# Altium project PCB_Project.PrjPcb
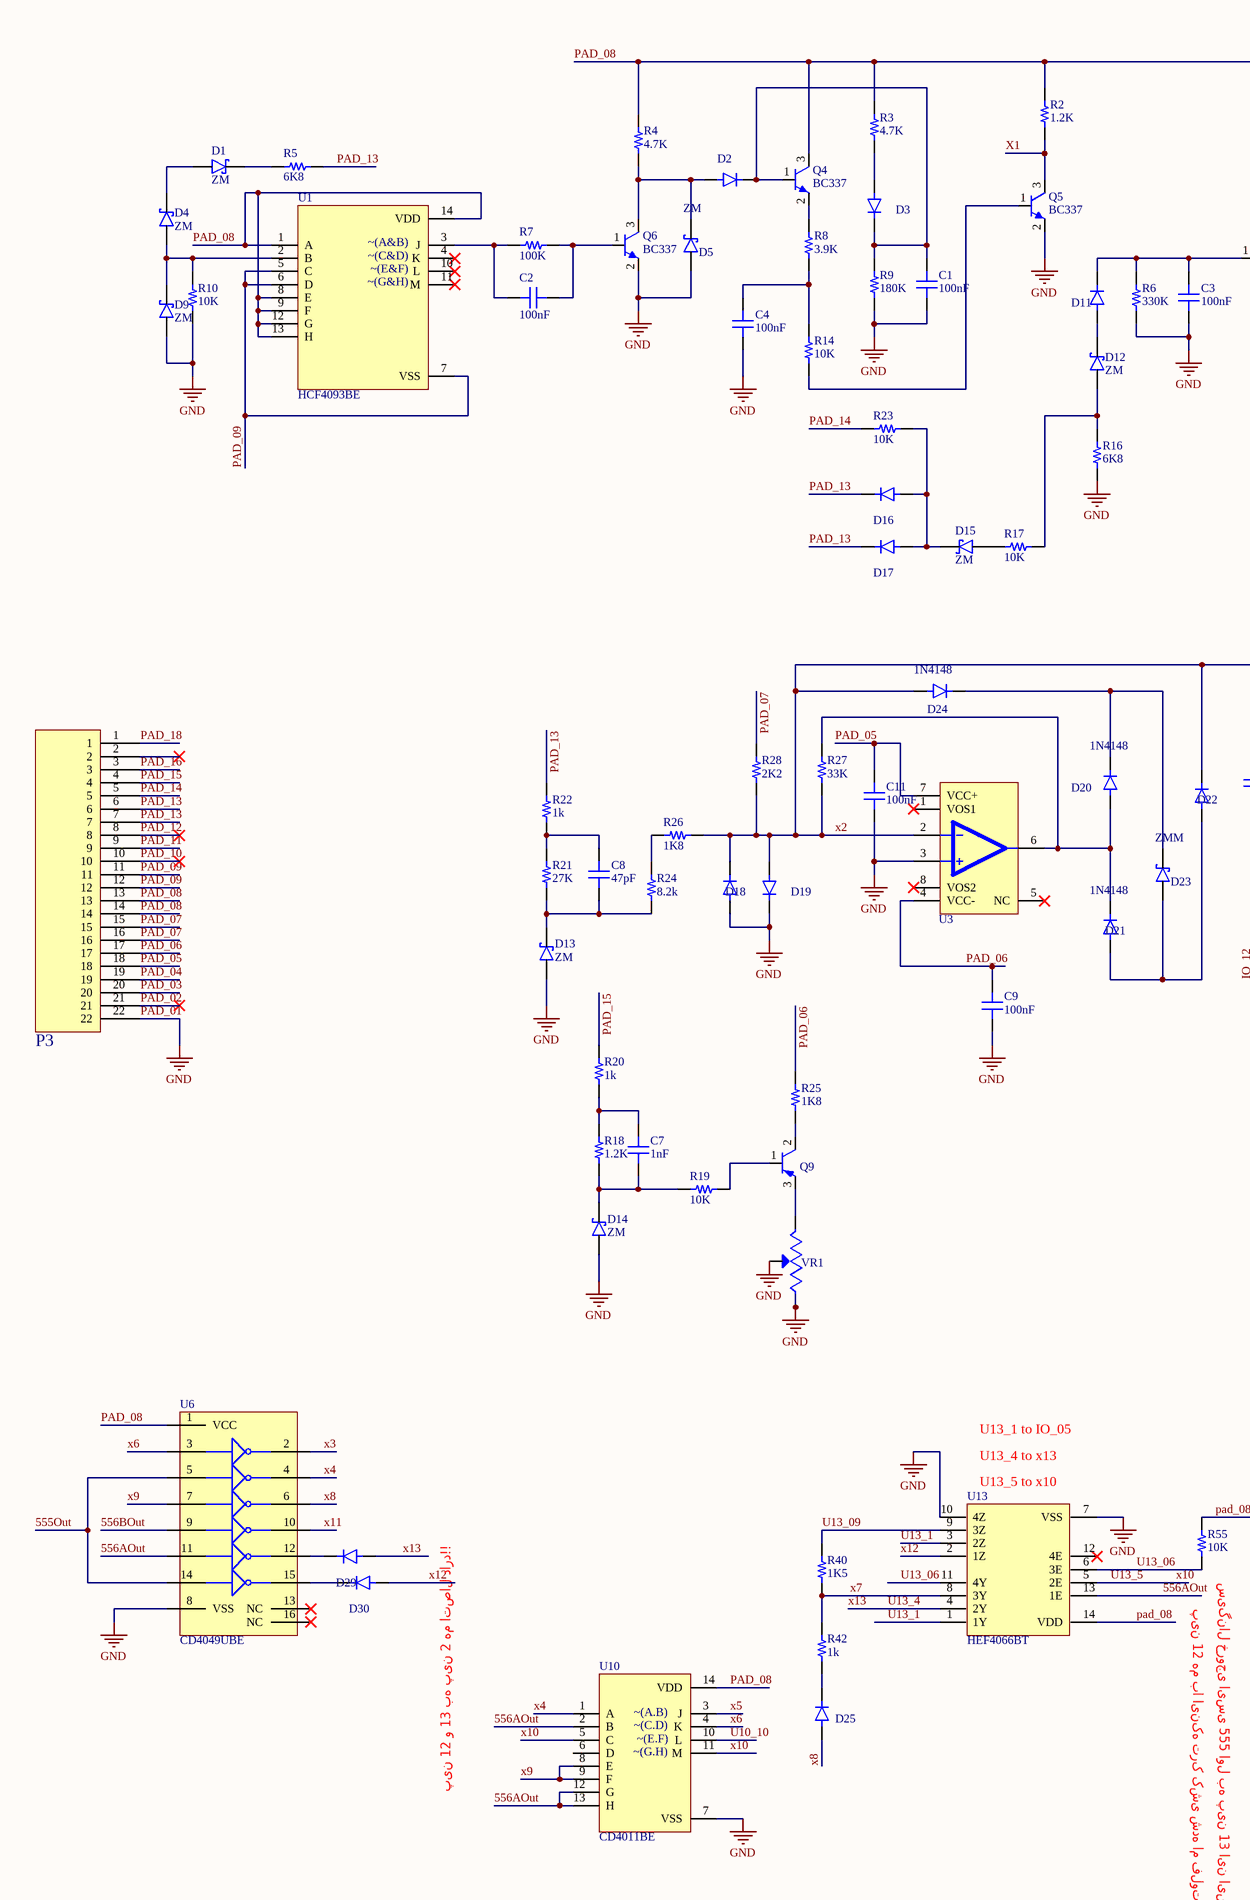
[diagram p0: Sheet1.SchDoc, left]
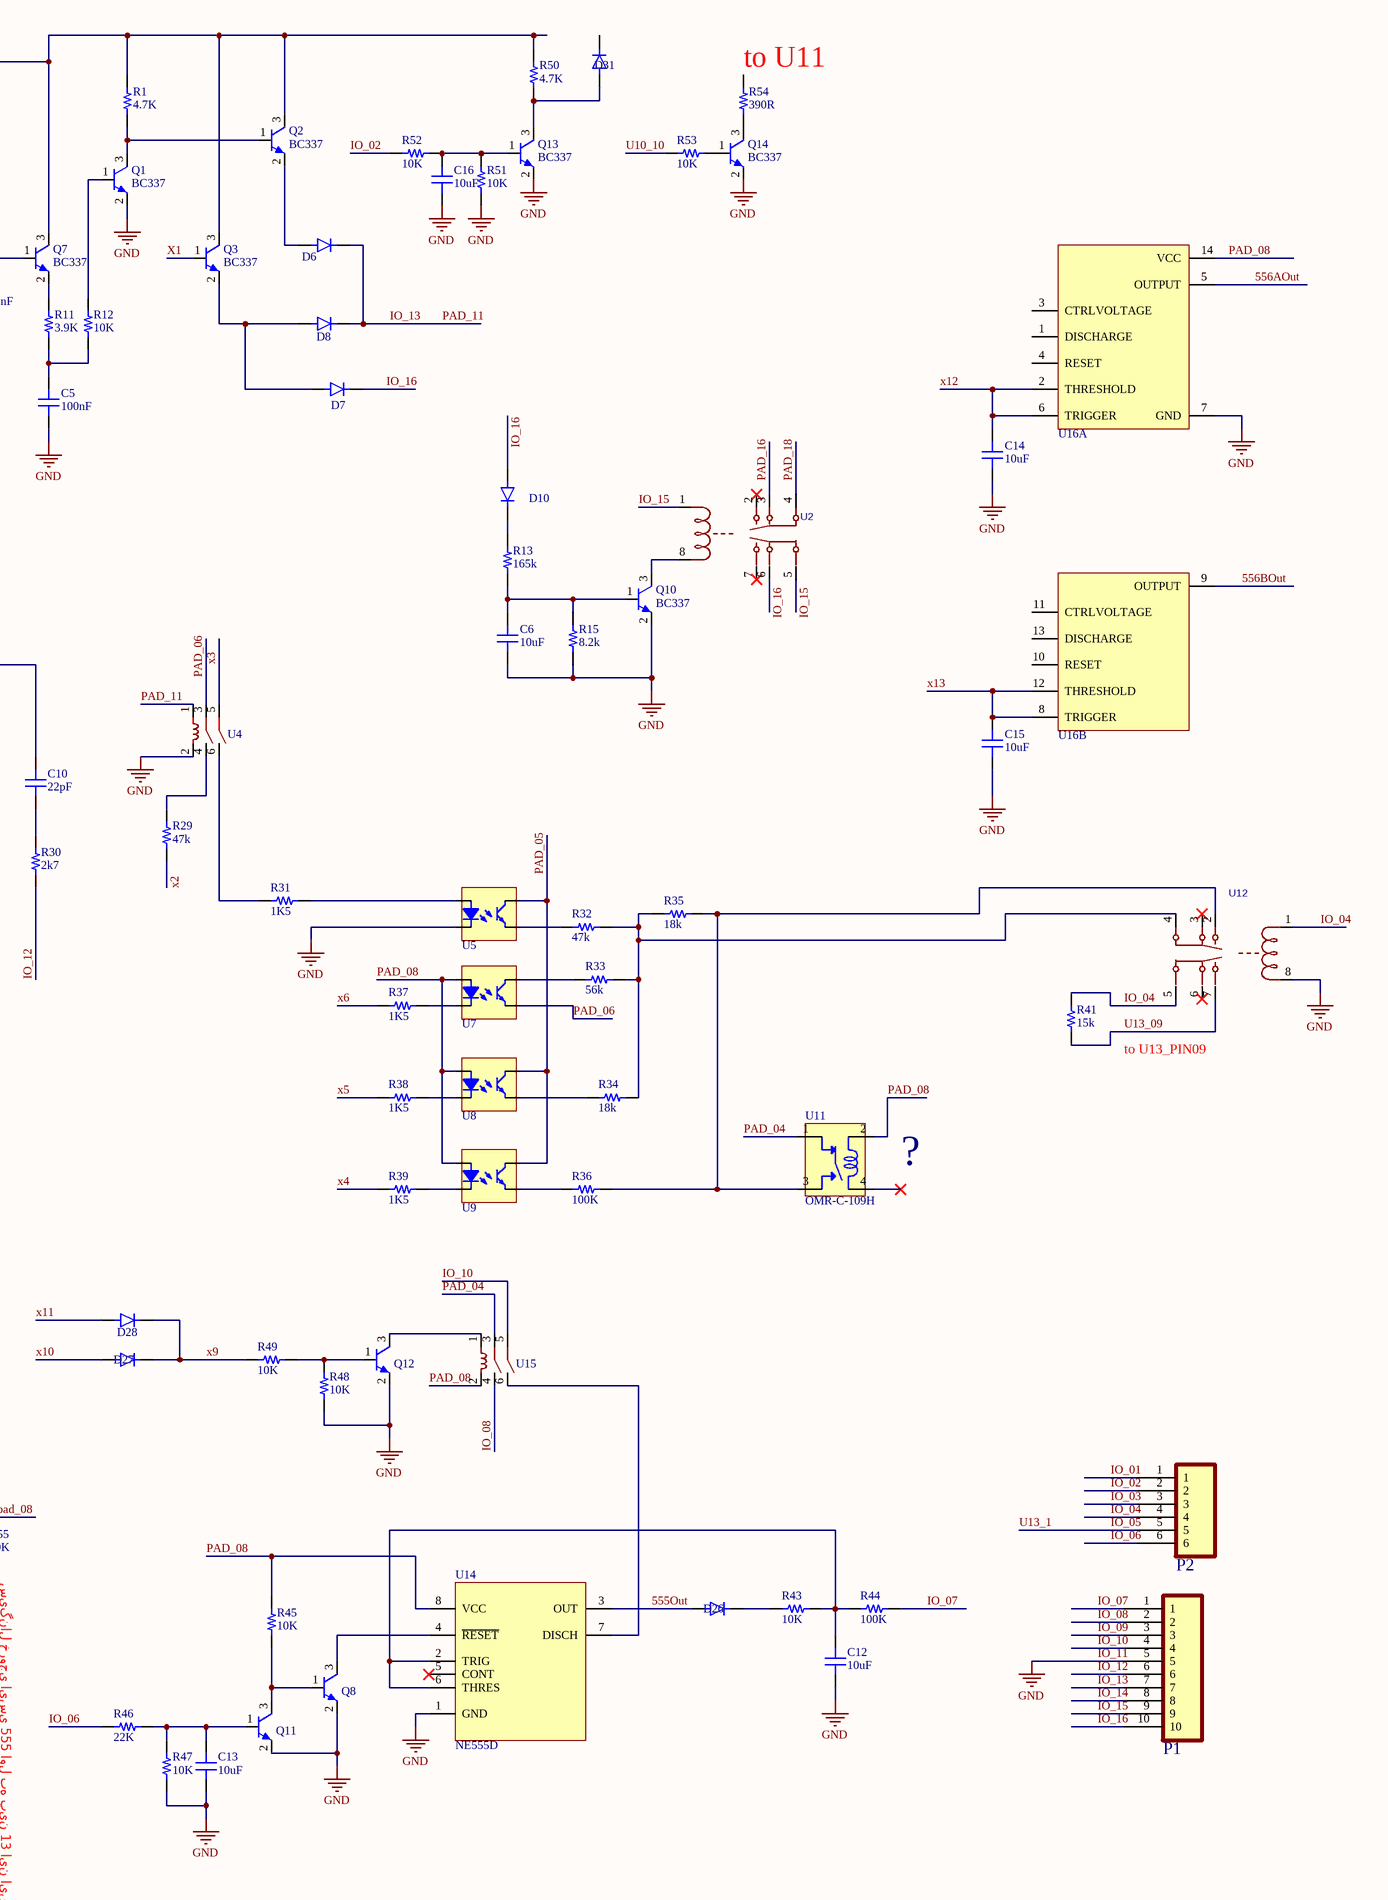
[diagram p1: Sheet1.SchDoc, right]
1 sheet, 136 parts. Net scope: global (net labels, ports and power ports of the same name join across sheets).

## Sheet Sheet1.SchDoc
size C

### Parts
C1  100nF  [Cap0805]
C2  100nF  [Cap0805]
C3  100nF  [Cap0805]
C4  100nF  [Cap0805]
C5  100nF  [Cap0805]
C6  10uF  [Cap0603]
C7  1nF  [Cap0805]
C8  47pF  [Cap0603]
C9  100nF  [Cap0805]
C10  22pF  [Cap0603]
C11  100nF  [Cap0805]
C12  10uF  [Cap1206]
C13  10uF  [Cap0805]
C14  10uF  [Cap1206]
C15  10uF  [Cap1206]
C16  10uF  [Cap1206]
D1  ZM  [Melf]
D2  1N4148  [SOD-123]  (value not drawn)
D3  1N4148  [SOD-123]  (value not drawn)
D4  ZM  [Melf]
D5  ZM  [Melf]
D6  1N4148  [SOD-123]  (value not drawn)
D7  1N4148  [SOD-123]  (value not drawn)
D8  1N4148  [SOD-123]  (value not drawn)
D9  ZM  [Melf]
D10  1N4148  [SOD-123]  (value not drawn)
D11  1N4148  [SOD-123]  (value not drawn)
D12  ZM  [Melf]
D13  ZM  [Melf]
D14  ZM  [Melf]
D15  ZM  [Melf]
D16  1N4148  [SOD-123]  (value not drawn)
D17  1N4148  [SOD-123]  (value not drawn)
D18  1N4148  [SOD-123]  (value not drawn)
D19  1N4148  [SOD-123]  (value not drawn)
D20  1N4148  [SOD-123]
D21  1N4148  [SOD-123]
D22  1N4148  [SOD-123]  (value not drawn)
D23  ZMM  [MINIMELF]
D24  1N4148  [SOD-123]
D25  1N4148  [SOD-123]  (value not drawn)
D26  1N4148  [SOD-123]  (value not drawn)
D27  1N4148  [SOD-123]  (value not drawn)
D28  1N4148  [SOD-123]  (value not drawn)
D29  1N4148  [SOD-123]  (value not drawn)
D30  1N4148  [SOD-123]  (value not drawn)
D31  1N4148  [SOD-123]  (value not drawn)
P1  PWR_HDR_10P  [PWR_HDR_10P]  (value not drawn)
P2  PWR_HDR_6P  [PWR_HDR_6P]  (value not drawn)
P3  PCI  [PCI]  (value not drawn)
Q1  BC337  [TO92]
Q2  BC337  [TO92]
Q3  BC337  [TO92]
Q4  BC337  [TO92]
Q5  BC337  [TO92]
Q6  BC337  [TO92]
Q7  BC337  [TO92]
Q8  BC337  [TO92]  (value not drawn)
Q9  BC177  [TO-18]  (value not drawn)
Q10  BC337  [TO92]
Q11  BC337  [TO92]  (value not drawn)
Q12  BC337  [TO92]  (value not drawn)
Q13  BC337  [TO92]
Q14  BC337  [TO92]
R1  4.7K  [Res1206]
R2  1.2K  [Res1206]
R3  4.7K  [Res1206]
R4  4.7K  [Res1206]
R5  6K8  [Res1206]
R6  330K  [Res1206]
R7  100K  [Res1206]
R8  3.9K  [Res1206]
R9  180K  [Res1206]
R10  10K  [Res1206]
R11  3.9K  [Res1206]
R12  10K  [Res1206]
R13  165k  [Res1206]
R14  10K  [Res1206]
R15  8.2k  [Res1206]
R16  6K8  [Res1206]
R17  10K  [Res1206]
R18  1.2K  [Res1206]
R19  10K  [Res1206]
R20  1k  [Res1206]
R21  27K  [Res1206]
R22  1k  [Res1206]
R23  10K  [Res1206]
R24  8.2k  [Res1206]
R25  1K8  [Res1206]
R26  1K8  [Res1206]
R27  33K  [Res1206]
R28  2K2  [Res1206]
R29  47k  [Res1206]
R30  2k7  [Res1206]
R31  1K5  [Res1206]
R32  47k  [Res1206]
R33  56k  [Res1206]
R34  18k  [Res1206]
R35  18k  [Res1206]
R36  100K  [Res0603]
R37  1K5  [Res1206]
R38  1K5  [Res1206]
R39  1K5  [Res1206]
R40  1K5  [Res1206]
R41  15k  [Res1206]
R42  1k  [Res1206]
R43  10K  [Res1206]
R44  100K  [Res1206]
R45  10K  [Res1206]
R46  22K  [Res1206]
R47  10K  [Res1206]
R48  10K  [Res1206]
R49  10K  [Res1206]
R50  4.7K  [Res1206]
R51  10K  [Res1206]
R52  10K  [Res1206]
R53  10K  [Res1206]
R54  390R  [Res1206]
R55  10K  [Res1206]
U1  HCF4093BE  [HCF4093BE]
U2  HRS2H-S-DC24V  [HRS2H-S-DC24V]  (value not drawn)
U3  OP07CD  [SOP8]  (value not drawn)
U4  OL-C-212H  [ol-c-212H]  (value not drawn)
U5  TLP521-1  [TLP521-1]  (value not drawn)
U6  CD4049UBE  [PDIP-16]
U7  TLP521-1  [TLP521-1]  (value not drawn)
U8  TLP521-1  [TLP521-1]  (value not drawn)
U9  TLP521-1  [TLP521-1]  (value not drawn)
U10  CD4011BE  [PDIP-14]
U11  OMR-C-109H
U12  HRS2H-S-DC24V  [HRS2H-S-DC24V]  (value not drawn)
U13  HEF4066BT  [SOIC-14]
U14  NE555D  [SOP8]
U15  OL-C-212H  [ol-c-212H]  (value not drawn)
U16  NE556D  [SOIC-14]  (value not drawn)  (parts A,B of 2)
VR1  10k  [Multi_Turn]  (value not drawn)

### Nets
IO_11: C1.1 C3.2 C4.1 C5.1 C6.1 C9.1 C11.1 C12.1 C13.1 C14.1 C15.1 C16.2 D5.A D9.A D13.A D14.A D18.A D19.C P1.5 P3.22 Q1.2(E) Q5.2(E) Q6.2(E) Q8.2(E) Q10.2(E) Q11.2(E) Q12.2(E) Q13.2(E) Q14.2(E) R6.1 R9.2 R10.1 R15.1 R16.1 R47.1 R48.1 R51.1 U3.3(IN+) U4.2 U5.2 U6.8(VSS) U10.7(VSS) U12.8 U13.7(VSS) U13.10(4Z) U14.1(GND) U16.7(GND) VR1.1(CCW) VR1.2(WIPER)  [also labelled GND, PAD_01]
555Out: D26.A U6.5(B) U6.14(F) U14.3(OUT)
556AOut: U6.11(E) U10.2(B) U10.12(G) U10.13(H) U13.13(1E) U16.5(OUTPUT)
556BOut: U6.9(D) U16.9(OUTPUT)
IO_01: P2.1
IO_02: P2.2 R52.2
IO_03: P2.3
IO_04: P2.4 R41.2 U12.1 U12.5
IO_05: P2.5 U13.1(1Y) U13.3(2Z)  [also labelled U13_1]
IO_06: P2.6 R46.1
IO_07: P1.1 R44.1
IO_08: P1.2 U15.4
IO_09: P1.3
IO_10: P1.4 U15.5
IO_12: P1.6 R30.1
IO_13: D6.C D8.C P1.7 P3.9 U4.1  [also labelled PAD_11]
IO_14: P1.8
IO_15: P1.9 U2.1 U2.5
IO_16: D7.C D10.A P1.10 U2.6
PAD_02: P3.21
PAD_03: P3.20
PAD_04: P3.19 U11.1 U15.3
PAD_05: C11.2 P3.18 U3.7(VCC+) U5.4 U8.4 U9.4
PAD_06: C9.2 P3.17 R25.1 U3.4(VCC-) U4.3 U7.3
PAD_07: P3.15 P3.16 R28.1
PAD_08: P3.13 P3.14 Q2.3(C) Q3.3(C) Q4.3(C) Q7.3(C) R1.1 R2.2 R3.2 R4.2 R45.2 R50.2 R55.2 U1.1(A) U1.8(E) U1.9(F) U1.12(G) U1.13(H) U1.14(VDD) U6.1(VCC) U7.1 U8.1 U9.1 U10.14(VDD) U11.2 U13.14(VDD) U14.8(VCC) U15.2 U16.14(VCC)
PAD_09: P3.11 P3.12 U1.5(C) U1.6(D) U1.7(VSS)
PAD_10: P3.10
PAD_12: P3.8
PAD_13: D16.C D17.C P3.6 P3.7 R5.2 R22.1
PAD_14: P3.5 R23.1
PAD_15: P3.4 R20.1
PAD_16: P3.3 U2.3
PAD_18: P3.1 U2.4
U10_10: R53.2 U10.10(L)
U13_4: C15.2 D29.A U13.4(2Y) U16.8(TRIGGER) U16.12(THRESHOLD)  [also labelled x13]
U13_5: D27.A U10.5(C) U10.11(M) U13.5(2E)  [also labelled x10]
U13_06: R55.1 U13.6(3E) U13.11(4Y)
U13_09: R40.1 R41.1 U12.7 U13.9(3Z)
X1: Q3.1(B) Q5.3(C) R2.1
x2: C10.2 D18.C D19.A D22.C D24.A R26.1 R27.1 R28.2 R29.1 U3.2(IN-)
x3: U4.5 U6.2(G)
x4: R39.1 U6.4(H) U10.1(A)
x5: R38.1 U10.3(J)
x6: R37.1 U6.3(A) U10.4(K)
x7: R40.2 R42.1 U13.8(3Y)
x8: D25.A U6.6(I)
x9: D27.C D28.C R49.2 U6.7(C) U10.8(E) U10.9(F)
x11: D28.A U6.10(J)
x12: C14.2 D30.A U13.2(1Z) U16.2(THRESHOLD) U16.6(TRIGGER)
NetC1_2: C1.2 D2.C D3.C Q4.1(B) R9.1
NetC2_1: C2.1 R7.1 U1.3(J)
NetC2_2: C2.2 Q6.1(B) R7.2
NetC3_1: C3.1 D11.C Q7.1(B) R6.2
NetC4_2: C4.2 R8.2 R14.2
NetC5_2: C5.2 R11.1 R12.1
NetC6_2: C6.2 Q10.1(B) R13.1 R15.2
NetC7_1: C7.1 D14.C R18.1 R19.1
NetC7_2: C7.2 R18.2 R20.2
NetC8_1: C8.1 D13.C R21.2 R24.2
NetC8_2: C8.2 R21.1 R22.2
NetC10_1: C10.1 R30.2
NetC12_2: C12.2 R43.2 R44.2 U14.2(TRIG) U14.6(THRES)
NetC13_2: C13.2 Q11.1(B) R46.2 R47.2
NetC16_1: C16.1 Q13.1(B) R51.2 R52.1
NetD1_A: D1.A D4.C
NetD1_C: D1.C R5.1
NetD2_A: D2.A D5.C Q6.3(C) R4.1
NetD3_A: D3.A R3.1
NetD4_A: D4.A D9.C R10.2 U1.2(B)
NetD6_A: D6.A Q2.2(E)
NetD7_A: D7.A D8.A Q3.2(E)
NetD10_C: D10.C R13.2
NetD11_A: D11.A D12.C
NetD12_A: D12.A R16.2 R17.2
NetD15_A: D15.A R17.1
NetD15_C: D15.C D16.A D17.A R23.2
NetD20_A: D20.A D21.C R27.2 U3.6(OUT)
NetD20_C: D20.C D23.C D24.C
NetD21_A: D21.A D22.A D23.A
NetD25_C: D25.C R42.2
NetD26_C: D26.C R43.1
NetD29_C: D29.C U6.12(K)
NetD30_C: D30.C U6.15(L)
NetD31_A: D31.A Q13.3(C) R50.1
NetQ1_1: Q1.1(B) R12.2
NetQ1_3: Q1.3(C) Q2.1(B) R1.2
NetQ4_2: Q4.2(E) R8.1
NetQ5_1: Q5.1(B) R14.1
NetQ7_2: Q7.2(E) R11.2
NetQ8_1: Q8.1(B) Q11.3(C) R45.1
NetQ8_3: Q8.3(C) U14.4(~{RESET})
NetQ9_1: Q9.1(B) R19.2
NetQ9_2: Q9.2(C) R25.2
NetQ9_3: Q9.3(E) VR1.3(CW)
NetQ10_3: Q10.3(C) U2.8
NetQ12_1: Q12.1(B) R48.2 R49.1
NetQ12_3: Q12.3(C) U15.1
NetQ14_1: Q14.1(B) R53.1
NetQ14_3: Q14.3(C) R54.1
NetR24_1: R24.1 R26.2
NetR29_2: R29.2 U4.4
NetR31_1: R31.1 U4.6
NetR31_2: R31.2 U5.1
NetR32_1: R32.1 R33.1 R34.1 R35.1 U12.4
NetR32_2: R32.2 U5.3
NetR33_2: R33.2 U7.4
NetR34_2: R34.2 U8.3
NetR35_2: R35.2 R36.2 U11.3 U12.2
NetR36_1: R36.1 U9.3
NetR37_2: R37.2 U7.2
NetR38_2: R38.2 U8.2
NetR39_2: R39.2 U9.2
NetU14_7: U14.7(DISCH) U15.6

Not connected (* = marked no-connect by the designer): D31 C; P3 2*; R54 2; U1 4(K)* 10(L)* 11(M)*; U2 2* 7*; U3 1(VOS1)* 5(NC)* 8(VOS2)*; U6 13(NC)* 16(NC)*; U10 6(D); U11 4*; U12 3* 6*; U13 12(4E)*; U14 5(CONT)*; U16 1(DISCHARGE) 3(CTRLVOLTAGE) 4(RESET) 10(RESET) 11(CTRLVOLTAGE) 13(DISCHARGE)

### Notes on the sheet
- (near R54) to U11
- to U13_PIN09
- ?
- U13_1 to IO_05
- U13_4 to x13
- (near U13) U13_5 to x10
- پین 12 هم با اینکه ترک کشی شده ام فلوت رها شده باز هم چک شود
- (near R55) سیگنال خروجی ایسی 555 اول به پین 13 این ایسی هم می اید
- پین 12 و 13 به پین 2 هم اتصال دارد!!
- (in symbol CD4011BE) ~(A.B); ~(C.D); ~(E.F); ~(G.H)
- (in symbol HCF4093BE) ~(A&B); ~(C&D); ~(E&F); ~(G&H)

### Library data of the parts
C1 C3-C5 C9 C11 = Cap-0805-100nF: Cap 0805 100nF; Manufacturer: ---; ID: 51; Additionner: S.Pourmohammad; Part Number: Cap-0805-100nF; Category: Cap; Sub-Category: Cer0805; Adding Time: 1402-05-18; Datasheet Path: ---; Supplier: Ic Kala
C2 = C0805C104K5RACAUTO: Multilayer Ceramic Capacitors MLCC - SMD 50V 100nF X7R 0805 10% AEC-Q200; Manufacturer: KEMET; ID: 11; Additionner: M.Moghimi; Part Number: C0805C104K5RACAUTO; Category: Cap; Sub-Category: Cer0805; Adding Time: 1400-09-09; Datasheet Path: Datasheets\KEM_C1002_X7R_SMD Capacitor Series.pdf
C6 = Cap-0603-10uF: Cap 0603 10uF; Manufacturer: ---; ID: 40; Additionner: A.Abdolahzadeh; Part Number: Cap-0603-10uF; Category: Cap; Sub-Category: Cer0603; Adding Time: 1401-05-17; Datasheet Path: ---
C7 = Cap-0805-1nF: Cap 0805 1nF; Manufacturer: ---; ID: 116; Additionner: S.Pourmohammad; Part Number: Cap-0805-1nF; Category: Cap; Sub-Category: Cer0805; Adding Time: 1402-05-18; Datasheet Path: ---; Supplier: Ic Kala
C8 = Cap-0603-47pF: Cap 0603 47pF; Manufacturer: ---; ID: 0; Additionner: A.Abdolahzadeh; Part Number: Cap-0603-47pF; Category: Cap; Sub-Category: Cer0603; Adding Time: 1402-09-24; Datasheet Path: ---
C10 = Cap-0603-22pF: Cap 0603 22pF; Manufacturer: ---; ID: 114; Additionner: A.Abdolahzadeh; Part Number: Cap-0603-22pF; Category: Cap; Sub-Category: Cer0603; Adding Time: 1401-04-30; Datasheet Path: ---; Supplier: Ic Kala
C12 C14-C16 = Cap-1206-10uF: Cap 1206 10uF 50V; Manufacturer: ---; ID: 48; Additionner: S.Pourmohammad; Part Number: Cap-1206-10uF; Category: Cap; Sub-Category: Cer1206; Adding Time: 1401-06-09; Datasheet Path: ---; Supplier: Ic Kala
C13 = Cap-0805-10uF: Cap 0805 10uF; Manufacturer: ---; ID: 49; Additionner: S.Pourmohammad; Part Number: Cap-0805-10uF; Category: Cap; Sub-Category: Cer0805; Adding Time: 1401-05-17; Datasheet Path: ---; Supplier: Ic Kala
D1 D5 D9 D15 = ZM: Zener Diode Melf; MP: TMMBAT41; MF: STMicroelectronics; ID: 132; Additionner: S.Pourmohammad; SnapEDA_Link: https://www.snapeda.com/parts/TMMBAT41/STMicroelectronics/view-part/2894620/?ref=snap; Value: *; Availability: Not in stock; Check_prices: https://www.snapeda.com/parts/TMMBAT41/STMicroelectronics/view-part/2894620/?ref=eda; Package: DO-213 STMicroelectronics; Price: None; Part Number: ZM; Category: Diode; Sub-Category: Zener
D2 D3 D6-D8 D10 D11 D16-D22 D24-D31 = 1N4148: Diode Standard 75 V 300mA (DC) Through Hole DO-35 Mimi Melf; MF: ON Semiconductor; ID: 113; Additionner: S.Pourmohammad; Price: None; Value: *; Check_prices: https://www.snapeda.com/parts/1N4148/Onsemi/view-part/?ref=eda; Purchase-URL: https://pricing.snapeda.com/search/part/1N4148/?ref=eda; Package: AXIAL LEAD-2 ON Semiconductor; SnapEDA_Link: https://www.snapeda.com/parts/1N4148/Onsemi/view-part/?ref=snap; Availability: In Stock; MP: 1N4148; Part Number: 1N4148; Category: Diode; Sub-Category: standard; Adding Time: 1402-10-1
D4 D12-D14 = ZM: Zener Diode Melf; MF: STMicroelectronics; MP: TMMBAT41; ID: 132; Additionner: S.Pourmohammad; Price: None; Value: *; Check_prices: https://www.snapeda.com/parts/TMMBAT41/STMicroelectronics/view-part/2894620/?ref=eda; Package: DO-213 STMicroelectronics; SnapEDA_Link: https://www.snapeda.com/parts/TMMBAT41/STMicroelectronics/view-part/2894620/?ref=snap; Availability: Not in stock; Part Number: ZM; Category: Diode; Sub-Category: Zener
D23 = ZMM: Zener Diode MiniMelf; MF: STMicroelectronics; MP: TMMBAT41; ID: 131; Additionner: S.Pourmohammad; Price: None; Value: *; Check_prices: https://www.snapeda.com/parts/TMMBAT41/STMicroelectronics/view-part/2894620/?ref=eda; Package: DO-213 STMicroelectronics; SnapEDA_Link: https://www.snapeda.com/parts/TMMBAT41/STMicroelectronics/view-part/2894620/?ref=snap; Availability: Not in stock; Part Number: ZMM; Category: Diode; Sub-Category: Zener
P1 = Power Connector 10 Pin: P-P= 3.96mm; ID: 101; Additionner: S.Pourmohammad; Part Number: Power Connector 10 Pin; Category: Connector; Sub-Category: Power Connector; Adding Time: 1402-10-1
P2 = Power Connector 6 Pin: P-P= 3.96mm; ID: 100; Additionner: S.Pourmohammad; Part Number: Power Connector 6 Pin; Category: Connector; Sub-Category: Power Connector; Adding Time: 1402-10-1
P3 = PCI: normal PAD for SPARK project; ID: 81; Additionner: S.Pourmohammad; Part Number: PCI; Category: Connector; Sub-Category: PCI; Adding Time: 1402-10-1
Q1-Q8 Q10-Q14 = BC337: Transistor; Manufacturer: Diodes-Incorporated; ID: 118; Additionner: S.Pourmohammad; Part Number: BC337; Category: Transistor; Sub-Category: BJT-NPN; Adding Time: 1402-10-1; Supplier: Ic Kala
Q9 = BC177: Manufacturer: ---; ID: 133; Additionner: A.Abdolahzadeh; MP: BCX53-16,115; MF: Nexperia USA; Part Number: BC177; Category: Transistor; Sub-Category: BJT-PNP; Adding Time: 1402-09-26; Datasheet Path: ---; Package: SOT-89-3 Nexperia; Price: None; Availability: Unavailable; Value: *; SnapEDA_Link: https://www.snapeda.com/parts/BCX53-16,115/Nexperia%20USA%20Inc./view-part/1098173/?ref=snap
R1 R3 R4 R50 = Res-1206-4.7k: Manufacturer: ---; Value: 1K; ID: 95; Additionner: A.Abdolahzadeh; Part Number: Res-1206-4.7k; Category: Res; Sub-Category: SMD-1206; Adding Time: 1402-09-24; Datasheet Path: ---
R2 R18 = Res-1206-1.2k: Manufacturer: ---; Value: 1K; ID: 92; Additionner: A.Abdolahzadeh; Part Number: Res-1206-1.2k; Category: Res; Sub-Category: SMD-1206; Adding Time: 1402-09-24; Datasheet Path: ---
R5 R16 = Res-1206-6K8: Resistor 1206 6.8 Kohm; Value: 1K; ID: 67; Additionner: S.Pourmohammad; Part Number: Res-1206-6K8; Category: Res; Sub-Category: SMD-1206; Adding Time: 1402-10-1; Supplier: Ic Kala
R6 = Res-1206-330K: Manufacturer: ---; Value: 1K; ID: 91; Additionner: A.Abdolahzadeh; Part Number: Res-1206-330K; Category: Res; Sub-Category: SMD-1206; Adding Time: 1402-09-24; Datasheet Path: ---
R7 R44 = Res-1206-100k: Manufacturer: ---; Value: 1K; ID: 96; Additionner: A.Abdolahzadeh; Part Number: Res-1206-100K; Category: Res; Sub-Category: SMD-1206; Adding Time: 1402-09-24; Datasheet Path: ---
R8 R11 = Res-1206-3.9k: Manufacturer: ---; Value: 1K; ID: 94; Additionner: A.Abdolahzadeh; Part Number: Res-1206-3.9k; Category: Res; Sub-Category: SMD-1206; Adding Time: 1402-09-24; Datasheet Path: ---
R9 = Res-1206-180k: Manufacturer: ---; Value: 1K; ID: 93; Additionner: A.Abdolahzadeh; Part Number: Res-1206-180k; Category: Res; Sub-Category: SMD-1206; Adding Time: 1402-09-24; Datasheet Path: ---
R10 R12 R14 R17 R19 R23 R43 R45 R47-R49 R51-R53 R55 = Res-1206-10K: Resistor 1206 10 Kohm; Manufacturer: ---; Value: 1K; ID: 66; Additionner: S.Pourmohammad; Part Number: Res-1206-10K; Category: Res; Sub-Category: SMD-1206; Adding Time: 1402-10-1; Datasheet Path: ---; Supplier: Ic Kala
R13 = Res-1206-165K: Manufacturer: ---; Value: 1K; ID: 111; Additionner: A.Abdolahzadeh; Part Number: Res-1206-165K; Category: Res; Adding Time: 1402-09-26; Datasheet Path: ---
R15 R24 = Res-1206-8.2K: Manufacturer: ---; Value: 1K; ID: 112; Additionner: A.Abdolahzadeh; Part Number: Res-1206-8.2K; Category: Res; Adding Time: 1402-09-26; Datasheet Path: ---
R20 R22 R42 = Res-1206-1K: Manufacturer: ---; ID: 88; Additionner: A.Abdolahzadeh; Value: 1K; Part Number: Res-1206-1K; Category: Res; Adding Time: 1402-09-26; Datasheet Path: ---
R21 = Res-1206-27K: Resistor 1206 27 Kohm; Value: 1K; ID: 70; Additionner: S.Pourmohammad; Part Number: Res-1206-27K; Category: Res; Sub-Category: SMD-1206; Adding Time: 1402-10-1; Supplier: Ic Kala
R25 R26 = Res-1206-1K8: Resistor 1206 1.8 Kohm; Value: 1K; ID: 102; Additionner: S.Pourmohammad; Part Number: Res-1206-1K8; Category: Res; Sub-Category: SMD-1206; Adding Time: 1402-10-1; Supplier: Ic Kala
R27 = Res-1206-33K: Resistor 1206 33 Kohm; Value: 1K; ID: 71; Additionner: S.Pourmohammad; Part Number: Res-1206-33K; Category: Res; Sub-Category: SMD-1206; Adding Time: 1402-10-1; Supplier: Ic Kala
R28 = Res-1206-2K2: Resistor 1206 2.2 Kohm; Value: 1K; ID: 82; Additionner: S.Pourmohammad; Part Number: Res-1206-2K2; Category: Res; Sub-Category: SMD-1206; Adding Time: 1402-10-1; Supplier: Ic Kala
R29 R32 = Res-1206-47K: Manufacturer: ---; Value: 1K; ID: 109; Additionner: A.Abdolahzadeh; Part Number: Res-1206-47K; Category: Res; Adding Time: 1402-09-26; Datasheet Path: ---
R30 = Res-1206-2K7: Manufacturer: ---; Value: 1K; ID: 110; Additionner: A.Abdolahzadeh; Part Number: Res-1206-2K7; Category: Res; Adding Time: 1402-09-26; Datasheet Path: ---
R31 R37-R40 = Res-1206-1K5: Resistor 1206 1.5 Kohm; Value: 1K; ID: 99; Additionner: S.Pourmohammad; Part Number: Res-1206-1K5; Category: Res; Sub-Category: SMD-1206; Adding Time: 1402-10-1; Supplier: Ic Kala
R33 = Res-1206-56K: Manufacturer: ---; Value: 1K; ID: 107; Additionner: A.Abdolahzadeh; Part Number: Res-1206-56K; Category: Res; Adding Time: 1402-09-26; Datasheet Path: ---
R34 R35 = Res-1206-18K: Manufacturer: ---; Value: 1K; ID: 108; Additionner: A.Abdolahzadeh; Part Number: Res-1206-18K; Category: Res; Adding Time: 1402-09-26; Datasheet Path: ---
R36 = Res-0603-100K: Resistor 0603 100K ohm; Manufacturer: ---; Value: 1K; ID: 11; Additionner: A.Abdolahzadeh; Part Number: Res-0603-100K; Category: Res; Sub-Category: SMD-0603; Adding Time: 1401-04-24; Datasheet Path: ---; Supplier: Ic Kala
R41 = Res-1206-15k: Manufacturer: ---; Value: 1K; ID: 98; Additionner: A.Abdolahzadeh; Part Number: Res-1206-15k; Category: Res; Sub-Category: SMD-1206; Adding Time: 1402-09-24; Datasheet Path: ---
R46 = Res-1206-22K: Resistor 1206 22 Kohm; Value: 1K; ID: 69; Additionner: S.Pourmohammad; Part Number: Res-1206-22K; Category: Res; Sub-Category: SMD-1206; Adding Time: 1402-10-1; Supplier: Ic Kala
R54 = Res-1206-390R: Manufacturer: ---; Value: 1K; ID: 106; Additionner: A.Abdolahzadeh; Part Number: Res-1206-390R; Category: Res; Adding Time: 1402-09-26; Datasheet Path: ---
U1 = HCF4093BE: 2 input NAND schmitt trigger with 4 channel; Manufacturer: ST; ID: 100; Additionner: A.Abdolahzadeh; Part Number: HCF4093BE; Category: Logic-IC; Sub-Category: NAND; Adding Time: 1402-9-24; Datasheet Path: Datasheets\HCF4093BE.pdf
U2 U12 = HRS2H-S-DC24V: Relay with 2 contact and 24VDC with 1A current; Manufacturer: HUIGANG; ID: 121; Additionner: S.Pourmohammad; Supplier: LCSC; Manufacturer Part: HRS2H-S-DC24V; Supplier Part: C12249; JLCPCB Part Class: Extended Part; spicePre: K; spiceSymbolName: HRS2H-S-DC24V; Part Number: HRS2H-S-DC24V; Category: Relay; Sub-Category: 2Contact; Adding Time: 1402-9-24; Datasheet Path: Datasheets\HRS2H-S-DC24v-h.pdf
U3 = OP07CD: Low-Offset voltage (0.25mV) single operational amplifier 8-SOIC 0 to 70; Manufacturer: Analog Device; MF: Texas Instruments; ID: 105; Additionner: A.Abdolahzadeh; Purchase-URL: https://pricing.snapeda.com/search/part/OP07CD/?ref=eda; Package: SOIC-8 Texas Instruments; SnapEDA_Link: https://www.snapeda.com/parts/OP07CD/Texas%20Instruments/view-part/516771/?ref=snap; Value: *; Price: None; MP: OP07CD; Availability: Unavailable; Part Number: OP07CD; Category: OpAmp; Sub-Category: 1 channel; Adding Time: 1402-09-26; Datasheet Path: Datasheets\OP07.pdf
U4 U15 = OL-C-212H: REED RELAY  2 Contact; ID: 130; Additionner: S.Pourmohammad; Part Number: OL-C-212H; Category: Relay; Sub-Category: RELAY REED SPDT; Adding Time: 1402-10-1; Supplier: ……..
U5 U7-U9 = TLP521-1: typical Optocoupler with 1 channel and DIP; Manufacturer: TOSHIBA; ID: 125; Additionner: A.Abdolahzadeh; Part Number: TLP521-1; Category: Optocoupler; Sub-Category: DIP; Adding Time: 1402-09-27; Datasheet Path: Datasheets\TLP521.pdf
U6 = CD4049UBE: 6-ch, 3-V to 18-V inverters; Manufacturer: Texas Instrument; ID: 127; Additionner: A.Abdolahzadeh; Part Number: CD4049UBE; Category: Logic-IC; Sub-Category: NOT; Adding Time: 1402-09-27; Datasheet Path: Datasheets\cd4049ub.pdf
U10 = CD4011BE: 4 channel CMOS NAND Gate with 2 input; Manufacturer: Texas Instrument; ID: 126; Additionner: A.Abdolahzadeh; Package: None; MP: CD4011BE; Value: *; Availability: Unavailable; Price: None; Part Number: CD4011BE; Category: Logic-IC; Sub-Category: NAND; Adding Time: 1402-09-27; Datasheet Path: Datasheets\CD4011BE.pdf
U11 = OMR-C-109H: Relay switch; Manufacturer: ---; ID: 68; Additionner: A.Abdolahzadeh; Part Number: OMR-C-109H; Category: Relay; Adding Time: 1402-09-27; Datasheet Path: ---
U13 = HEF4066BT: 4 Channel Circuit Analog IC Switch 1:1 with Enable; Manufacturer: Nexperia; MF: NXP Semiconductors; ID: 129; Additionner: A.Abdolahzadeh; Availability: Unavailable; Package: SO-14 NXP Semiconductors; MP: HEF4066BT; Value: *; Price: None; SnapEDA_Link: https://www.snapeda.com/parts/HEF4066BT/NXP%20Semiconductors/view-part/4303716/?ref=snap; Part Number: HEF4066BT; Category: Switch; Sub-Category: IC; Adding Time: 1402-09-27; Datasheet Path: Datasheets\HEF4066B-2938016.pdf
U14 = NE555D: 555 Type, Timer/Oscillator (Single) IC 500kHz 8-SOIC; Manufacturer: ST; MF: STMicroelectronics; ID: 104; Additionner: A.Abdolahzadeh; Availability: In Stock; SnapEDA_Link: https://www.snapeda.com/parts/NE555D/STMicroelectronics/view-part/?ref=snap; Price: None; Check_prices: https://www.snapeda.com/parts/NE555D/STMicroelectronics/view-part/?ref=eda; Package: SOIC-8 Texas Instruments; MP: NE555D; Value: *; Purchase-URL: https://pricing.snapeda.com/search/part/NE555D/?ref=eda; Part Number: NE555D; Category: Logic-IC; Sub-Category: Timer; Adding Time: 1402-09-26; Datasheet Path: Datasheets\NE555.pdf
U16 = NE556D: Dual 555 Timer 500kHz; Manufacturer: ST; MF: STMicroelectronics; ID: 128; Additionner: A.Abdolahzadeh; Value: *; Availability: Unavailable; Package: SOIC-14 Texas Instruments; Price: None; SnapEDA_Link: https://www.snapeda.com/parts/NE556D/STMicroelectronics/view-part/12906/?ref=snap; MP: NE556D; Part Number: NE556D; Category: Logic-IC; Sub-Category: Timer; Adding Time: 1402-09-27; Datasheet Path: Datasheets\NE556D.pdf
VR1 = Res Variable: Resistor Variable Multi turn; ID: 113; Additionner: S.Pourmohammad; MP: 3296W-OT1-204; MF: Bourns; Value: *; Part Number: Res Variable; Category: Res; Adding Time: 1402-09-26; SnapEDA_Link: https://www.snapeda.com/parts/3296W-OT1-204/Bourns/view-part/?ref=snap; Package: SOT-23-5 Bourns; Check_prices: https://www.snapeda.com/parts/3296W-OT1-204/Bourns/view-part/?ref=eda; Price: None; Availability: Not in stock